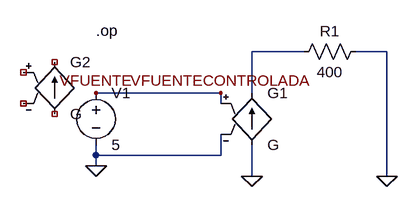
[diagram p0: schematic FTECONTROLADA2c.asc]
FTECONTROLADA2c.asc, the LTspice schematic file:
Version 4
SHEET 1 880 680
WIRE 352 48 272 48
WIRE 480 48 432 48
WIRE 224 112 32 112
WIRE 272 112 272 48
WIRE 224 128 224 112
WIRE 32 208 32 192
WIRE 224 208 224 176
WIRE 224 208 32 208
WIRE 32 224 32 208
WIRE 272 240 272 192
WIRE 480 240 480 48
FLAG 32 224 0
FLAG 272 240 0
FLAG 480 240 0
FLAG 32 112 VFUENTE
FLAG 224 112 VFUENTECONTROLADA
SYMBOL voltage 32 96 R0
SYMATTR InstName V1
SYMATTR Value 5
SYMBOL res 448 32 R90
WINDOW 0 0 56 VBottom 2
WINDOW 3 32 56 VTop 2
SYMATTR InstName R1
SYMATTR Value 400
SYMBOL g 272 96 R0
SYMATTR InstName G1
SYMBOL g -32 48 R0
SYMATTR InstName G2
TEXT 32 16 Left 2 !.op

The netlist it stands for:
* FTECONTROLADA2c.asc
V1 VFUENTECONTROLADA 0 5
R1 0 N001 400
G1 0 N001 VFUENTECONTROLADA 0 G
G2 NC_01 NC_02 NC_03 NC_04 G
.op
.backanno
.end